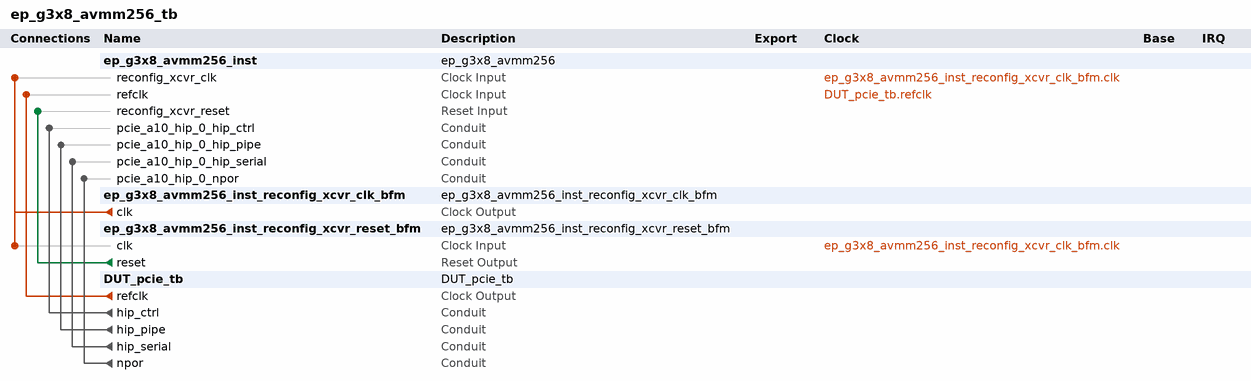
[diagram p0: system contents]
# Platform Designer (Qsys) system ep_g3x8_avmm256_tb, Arria 10 10AT115S2F45E2SG
# Parameters at their usual value, and those the tool derives, are not listed.
package require -exact qsys 1.0
create_system ep_g3x8_avmm256_tb
set_project_property DEVICE_FAMILY {Arria 10}
set_project_property DEVICE 10AT115S2F45E2SG

add_component ep_g3x8_avmm256_inst /home/dai/WorkStation/fpga/project/intel/PcieDma/ep_g3x8_avmm256.qsys ep_g3x8_avmm256 ep_g3x8_avmm256_inst 

add_component ep_g3x8_avmm256_inst_reconfig_xcvr_clk_bfm ip/ep_g3x8_avmm256_tb/ep_g3x8_avmm256_inst_reconfig_xcvr_clk_bfm_ip.ip ep_g3x8_avmm256_inst_reconfig_xcvr_clk_bfm ep_g3x8_avmm256_inst_reconfig_xcvr_clk_bfm 1.0
load_component ep_g3x8_avmm256_inst_reconfig_xcvr_clk_bfm
set_component_parameter_value CLOCK_RATE 100000000
set_component_parameter_value CLOCK_UNIT 1
save_component

add_component ep_g3x8_avmm256_inst_reconfig_xcvr_reset_bfm ip/ep_g3x8_avmm256_tb/ep_g3x8_avmm256_inst_reconfig_xcvr_reset_bfm_ip.ip ep_g3x8_avmm256_inst_reconfig_xcvr_reset_bfm ep_g3x8_avmm256_inst_reconfig_xcvr_reset_bfm 1.0
load_component ep_g3x8_avmm256_inst_reconfig_xcvr_reset_bfm
set_component_parameter_value ASSERT_HIGH_RESET 0
set_component_parameter_value INITIAL_RESET_CYCLES 50
save_component

add_component DUT_pcie_tb ip/ep_g3x8_avmm256_tb/DUT_pcie_tb_ip.ip DUT_pcie_tb DUT_pcie_tb 1.0
load_component DUT_pcie_tb
set_component_parameter_value lane_mask_hwtcl x8
set_component_parameter_value gen123_lane_rate_mode_hwtcl {Gen3 (8.0 Gbps)}
set_component_parameter_value port_type_hwtcl {Native endpoint}
set_component_parameter_value pll_refclk_freq_hwtcl {100 MHz}
set_component_parameter_value apps_type_hwtcl 6
set_component_parameter_value serial_sim_hwtcl 1
set_component_parameter_value deemphasis_enable_hwtcl false
set_component_parameter_value pld_clk_MHz 125
set_component_parameter_value millisecond_cycle_count_hwtcl 124250
set_component_parameter_value use_crc_forwarding_hwtcl 0
set_component_parameter_value ecrc_check_capable_hwtcl 0
set_component_parameter_value ecrc_gen_capable_hwtcl 0
set_component_parameter_value bfm_drive_interface_clk_hwtcl 1
set_component_parameter_value bfm_drive_interface_npor_hwtcl 1
set_component_parameter_value bfm_drive_interface_pipe_hwtcl 1
set_component_parameter_value bfm_drive_interface_control_hwtcl 1
set_component_parameter_value enable_pipe32_phyip_ser_driver_hwtcl 0
save_component

# connections
add_connection DUT_pcie_tb.refclk ep_g3x8_avmm256_inst.refclk clock
add_connection ep_g3x8_avmm256_inst_reconfig_xcvr_clk_bfm.clk ep_g3x8_avmm256_inst.reconfig_xcvr_clk clock
add_connection ep_g3x8_avmm256_inst_reconfig_xcvr_clk_bfm.clk ep_g3x8_avmm256_inst_reconfig_xcvr_reset_bfm.clk clock
add_connection ep_g3x8_avmm256_inst_reconfig_xcvr_reset_bfm.reset ep_g3x8_avmm256_inst.reconfig_xcvr_reset reset
add_connection DUT_pcie_tb.hip_ctrl ep_g3x8_avmm256_inst.pcie_a10_hip_0_hip_ctrl conduit
add_connection DUT_pcie_tb.hip_pipe ep_g3x8_avmm256_inst.pcie_a10_hip_0_hip_pipe conduit
add_connection DUT_pcie_tb.hip_serial ep_g3x8_avmm256_inst.pcie_a10_hip_0_hip_serial conduit
add_connection DUT_pcie_tb.npor ep_g3x8_avmm256_inst.pcie_a10_hip_0_npor conduit

set_interconnect_requirement {$system} qsys_mm.clockCrossingAdapter HANDSHAKE
set_interconnect_requirement {$system} qsys_mm.enableEccProtection FALSE
set_interconnect_requirement {$system} qsys_mm.insertDefaultSlave FALSE
set_interconnect_requirement {$system} qsys_mm.maxAdditionalLatency 1

save_system ep_g3x8_avmm256_tb.qsys
